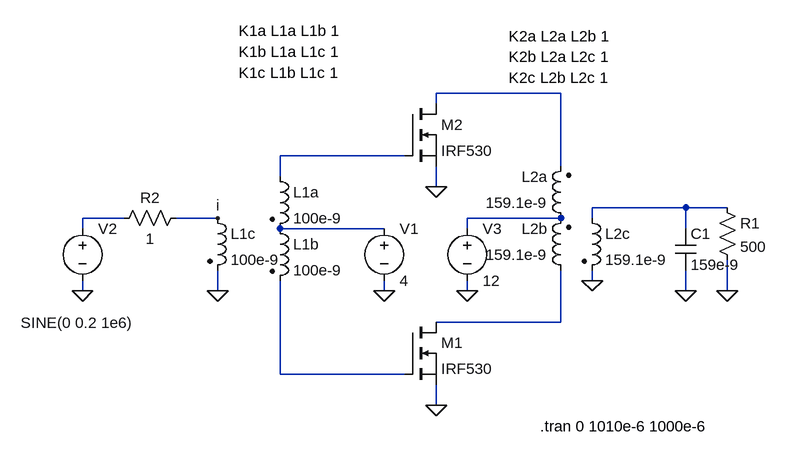
[diagram p0: schematic pushpull.asc]
pushpull.asc, the LTspice schematic file:
Version 4
SHEET 1 880 680
WIRE -32 -496 -224 -496
WIRE -224 -480 -224 -496
WIRE -272 -400 -464 -400
WIRE -32 -384 -32 -496
WIRE -464 -368 -464 -400
WIRE -224 -352 -224 -384
WIRE 160 -320 16 -320
WIRE 224 -320 160 -320
WIRE -704 -304 -768 -304
WIRE -560 -304 -624 -304
WIRE -32 -304 -176 -304
WIRE 16 -304 16 -320
WIRE -768 -288 -768 -304
WIRE -304 -288 -464 -288
WIRE -176 -288 -176 -304
WIRE 160 -288 160 -320
WIRE 16 -208 16 -224
WIRE -768 -192 -768 -208
WIRE -560 -192 -560 -224
WIRE -304 -192 -304 -208
WIRE -176 -192 -176 -208
WIRE 160 -192 160 -224
WIRE 224 -192 224 -240
WIRE -32 -144 -32 -224
WIRE -32 -144 -224 -144
WIRE -464 -64 -464 -208
WIRE -272 -64 -464 -64
WIRE -224 -16 -224 -48
FLAG -224 -16 0
FLAG -768 -192 0
FLAG -304 -192 0
FLAG -560 -304 i
FLAG 224 -192 0
FLAG -224 -352 0
FLAG -176 -192 0
FLAG -560 -192 0
FLAG 16 -208 0
FLAG 160 -192 0
SYMBOL voltage -304 -304 R0
WINDOW 123 0 0 Left 2
WINDOW 39 0 0 Left 2
SYMATTR InstName V1
SYMATTR Value 4
SYMBOL res 208 -336 R0
SYMATTR InstName R1
SYMATTR Value 500
SYMBOL voltage -768 -304 R0
WINDOW 3 -95 161 Left 2
WINDOW 123 0 0 Left 2
WINDOW 39 0 0 Left 2
SYMATTR Value SINE(0 0.2 1e6)
SYMATTR InstName V2
SYMBOL nmos -272 -144 R0
SYMATTR InstName M1
SYMATTR Value IRF530
SYMBOL nmos -272 -480 R0
SYMATTR InstName M2
SYMATTR Value IRF530
SYMBOL ind2 -16 -288 R180
WINDOW 0 36 80 Left 2
WINDOW 3 36 40 Left 2
SYMATTR InstName L2a
SYMATTR Value 159.1e-9
SYMATTR Type ind
SYMBOL ind2 -16 -208 R180
WINDOW 0 36 80 Left 2
WINDOW 3 36 40 Left 2
SYMATTR InstName L2b
SYMATTR Value 159.1e-9
SYMATTR Type ind
SYMBOL ind2 -480 -304 R0
SYMATTR InstName L1b
SYMATTR Value 100e-9
SYMATTR Type ind
SYMBOL ind2 -480 -384 R0
SYMATTR InstName L1a
SYMATTR Value 100e-9
SYMATTR Type ind
SYMBOL voltage -176 -304 R0
SYMATTR InstName V3
SYMATTR Value 12
SYMBOL ind2 -576 -320 R0
SYMATTR InstName L1c
SYMATTR Value 100e-9
SYMATTR Type ind
SYMBOL ind2 0 -320 R0
SYMATTR InstName L2c
SYMATTR Value 159.1e-9
SYMATTR Type ind
SYMBOL res -608 -320 R90
WINDOW 0 0 56 VBottom 2
WINDOW 3 32 56 VTop 2
SYMATTR InstName R2
SYMATTR Value 1
SYMBOL cap 144 -288 R0
SYMATTR InstName C1
SYMATTR Value 159e-9
TEXT -64 16 Left 2 !.tran 0 1010e-6 1000e-6
TEXT -528 -528 Left 2 !K1c L1b L1c 1
TEXT -528 -560 Left 2 !K1b L1a L1c 1
TEXT -528 -592 Left 2 !K1a L1a L1b 1
TEXT -112 -520 Left 2 !K2c L2b L2c 1
TEXT -112 -552 Left 2 !K2b L2a L2c 1
TEXT -112 -584 Left 2 !K2a L2a L2b 1

The netlist it stands for:
* pushpull.asc
V1 N006 0 4
R1 N003 0 500
V2 N004 0 SINE(0 0.2 1e6)
M1 N007 N008 0 0 IRF530
M2 N001 N002 0 0 IRF530
L2a N005 N001 159.1e-9
L2b N007 N005 159.1e-9
L1b N006 N008 100e-9
L1a N002 N006 100e-9
V3 N005 0 12
L1c i 0 100e-9
L2c N003 0 159.1e-9
R2 i N004 1
C1 N003 0 159e-9
.model NMOS NMOS
.model PMOS PMOS
.lib standard.mos
.tran 0 1010e-6 1000e-6
K1c L1b L1c 1
K1b L1a L1c 1
K1a L1a L1b 1
K2c L2b L2c 1
K2b L2a L2c 1
K2a L2a L2b 1
.backanno
.end